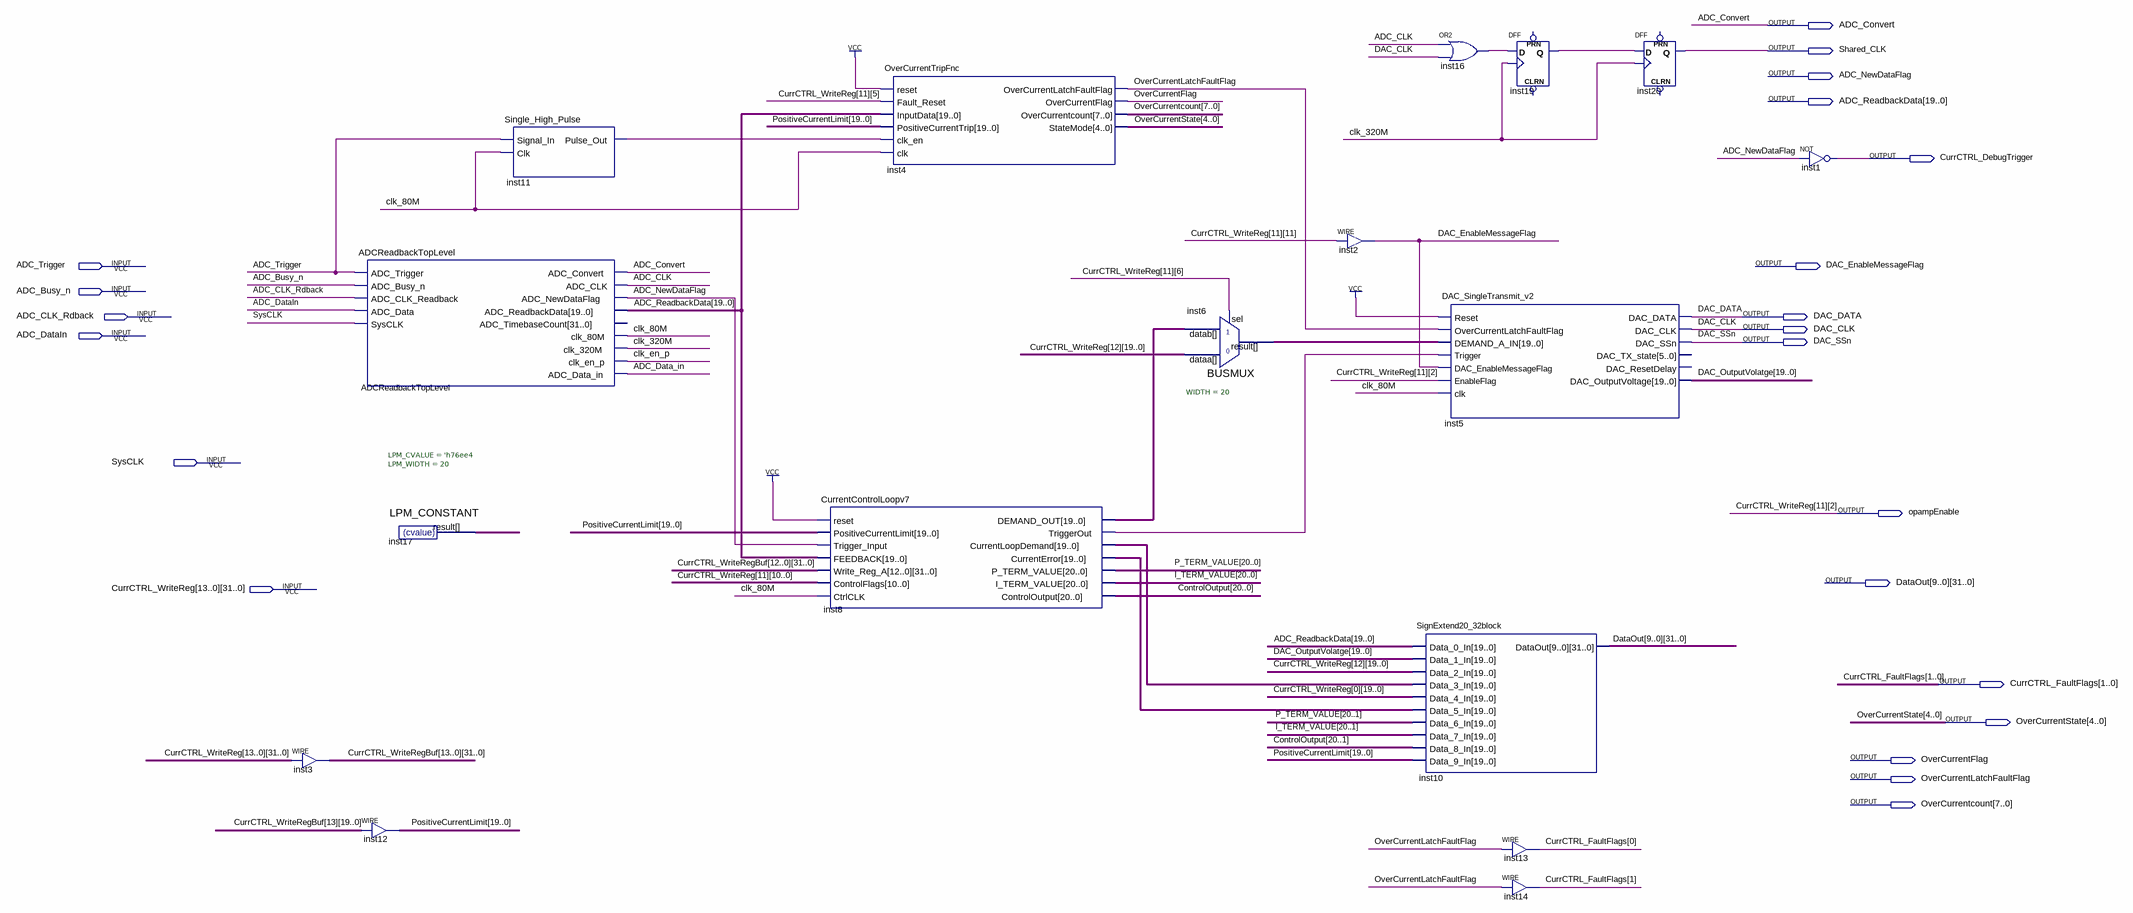
[diagram p0: schematic sheet]
// Quartus schematic CurrentControlTopLevel.bdf as structural Verilog: 17 symbols, 22 pins
module CurrentControlTopLevel (
  input  ADC_Trigger,
  input  ADC_Busy_n,
  input  ADC_CLK_Rdback,
  input  ADC_DataIn,
  input  SysCLK,
  input  [31:0] CurrCTRL_WriteReg_13,
  input  [31:0] CurrCTRL_WriteReg_12,
  input  [31:0] CurrCTRL_WriteReg_11,
  input  [31:0] CurrCTRL_WriteReg_10,
  input  [31:0] CurrCTRL_WriteReg_9,
  input  [31:0] CurrCTRL_WriteReg_8,
  input  [31:0] CurrCTRL_WriteReg_7,
  input  [31:0] CurrCTRL_WriteReg_6,
  input  [31:0] CurrCTRL_WriteReg_5,
  input  [31:0] CurrCTRL_WriteReg_4,
  input  [31:0] CurrCTRL_WriteReg_3,
  input  [31:0] CurrCTRL_WriteReg_2,
  input  [31:0] CurrCTRL_WriteReg_1,
  input  [31:0] CurrCTRL_WriteReg_0,
  output ADC_Convert,
  output Shared_CLK,
  output ADC_NewDataFlag,
  output [19:0] ADC_ReadbackData,
  output CurrCTRL_DebugTrigger,
  output DAC_EnableMessageFlag,
  output DAC_DATA,
  output DAC_CLK,
  output DAC_SSn,
  output opampEnable,
  output [31:0] DataOut_9,
  output [31:0] DataOut_8,
  output [31:0] DataOut_7,
  output [31:0] DataOut_6,
  output [31:0] DataOut_5,
  output [31:0] DataOut_4,
  output [31:0] DataOut_3,
  output [31:0] DataOut_2,
  output [31:0] DataOut_1,
  output [31:0] DataOut_0,
  output [1:0] CurrCTRL_FaultFlags,
  output [4:0] OverCurrentState,
  output OverCurrentFlag,
  output OverCurrentLatchFaultFlag,
  output [7:0] OverCurrentcount
);

  wire ADC_CLK, ADC_Data_in, clk_80M, clk_320M, clk_en_p, inst8_triggerout, inst11_pulse_out, inst16_out,
       inst19_q;
  wire [19:0] DAC_OutputVolatge, inst6_result, inst8_currenterror, inst8_currentloopdemand, inst8_demand_out,
       inst17_result, PositiveCurrentLimit;
  wire [20:0] ControlOutput, I_TERM_VALUE, P_TERM_VALUE;
  wire [31:0] CurrCTRL_WriteRegBuf_0, CurrCTRL_WriteRegBuf_1, CurrCTRL_WriteRegBuf_2, CurrCTRL_WriteRegBuf_3,
       CurrCTRL_WriteRegBuf_4, CurrCTRL_WriteRegBuf_5, CurrCTRL_WriteRegBuf_6, CurrCTRL_WriteRegBuf_7,
       CurrCTRL_WriteRegBuf_8, CurrCTRL_WriteRegBuf_9, CurrCTRL_WriteRegBuf_10, CurrCTRL_WriteRegBuf_11,
       CurrCTRL_WriteRegBuf_12, CurrCTRL_WriteRegBuf_13;

  assign {CurrCTRL_WriteRegBuf_13, CurrCTRL_WriteRegBuf_12, CurrCTRL_WriteRegBuf_11, CurrCTRL_WriteRegBuf_10, CurrCTRL_WriteRegBuf_9, CurrCTRL_WriteRegBuf_8, CurrCTRL_WriteRegBuf_7, CurrCTRL_WriteRegBuf_6, CurrCTRL_WriteRegBuf_5, CurrCTRL_WriteRegBuf_4, CurrCTRL_WriteRegBuf_3, CurrCTRL_WriteRegBuf_2, CurrCTRL_WriteRegBuf_1, CurrCTRL_WriteRegBuf_0} = {CurrCTRL_WriteReg_13, CurrCTRL_WriteReg_12, CurrCTRL_WriteReg_11, CurrCTRL_WriteReg_10, CurrCTRL_WriteReg_9, CurrCTRL_WriteReg_8, CurrCTRL_WriteReg_7, CurrCTRL_WriteReg_6, CurrCTRL_WriteReg_5, CurrCTRL_WriteReg_4, CurrCTRL_WriteReg_3, CurrCTRL_WriteReg_2, CurrCTRL_WriteReg_1, CurrCTRL_WriteReg_0};  // WIRE inst3
  ADCReadbackTopLevel ADCReadbackTopLevel (
    .ADC_Trigger(ADC_Trigger), .ADC_Busy_n(ADC_Busy_n), .ADC_CLK_Readback(ADC_CLK_Rdback),
    .ADC_Data(ADC_DataIn), .SysCLK(SysCLK), .ADC_Convert(ADC_Convert), .ADC_CLK(ADC_CLK),
    .ADC_NewDataFlag(ADC_NewDataFlag), .ADC_ReadbackData(ADC_ReadbackData), .clk_80M(clk_80M),
    .clk_320M(clk_320M), .clk_en_p(clk_en_p), .ADC_Data_in(ADC_Data_in));  // open: ADC_TimebaseCount
  LPM_CONSTANT #(.LPM_CVALUE('h76ee4), .LPM_WIDTH(20)) inst17 (.result(inst17_result));
  assign PositiveCurrentLimit = CurrCTRL_WriteRegBuf_13[19:0];  // WIRE inst12
  Single_High_Pulse inst11 (.Signal_In(ADC_Trigger), .Clk(clk_80M), .Pulse_Out(inst11_pulse_out));
  CurrentControlLoopv7 inst8 (
    .reset(1'b1), .PositiveCurrentLimit(PositiveCurrentLimit), .Trigger_Input(ADC_NewDataFlag),
    .FEEDBACK(ADC_ReadbackData),
    .Write_Reg_A({CurrCTRL_WriteRegBuf_12, CurrCTRL_WriteRegBuf_11, CurrCTRL_WriteRegBuf_10, CurrCTRL_WriteRegBuf_9, CurrCTRL_WriteRegBuf_8, CurrCTRL_WriteRegBuf_7, CurrCTRL_WriteRegBuf_6, CurrCTRL_WriteRegBuf_5, CurrCTRL_WriteRegBuf_4, CurrCTRL_WriteRegBuf_3, CurrCTRL_WriteRegBuf_2, CurrCTRL_WriteRegBuf_1, CurrCTRL_WriteRegBuf_0}),
    .ControlFlags(CurrCTRL_WriteReg_11[10:0]), .CtrlCLK(clk_80M), .DEMAND_OUT(inst8_demand_out),
    .TriggerOut(inst8_triggerout), .CurrentLoopDemand(inst8_currentloopdemand),
    .CurrentError(inst8_currenterror), .P_TERM_VALUE(P_TERM_VALUE), .I_TERM_VALUE(I_TERM_VALUE),
    .ControlOutput(ControlOutput));
  OverCurrentTripFnc inst4 (
    .reset(1'b1), .Fault_Reset(CurrCTRL_WriteReg_11[5]), .InputData(ADC_ReadbackData),
    .PositiveCurrentTrip(PositiveCurrentLimit), .clk_en(inst11_pulse_out), .clk(clk_80M),
    .OverCurrentLatchFaultFlag(OverCurrentLatchFaultFlag), .OverCurrentFlag(OverCurrentFlag),
    .OverCurrentcount(OverCurrentcount), .StateMode(OverCurrentState));
  BUSMUX #(.WIDTH(20)) inst6 (
    .datab(inst8_demand_out), .sel(CurrCTRL_WriteReg_11[6]), .dataa(CurrCTRL_WriteReg_12[19:0]),
    .result(inst6_result));
  assign DAC_EnableMessageFlag = CurrCTRL_WriteReg_11[11];  // WIRE inst2
  or inst16 (inst16_out, ADC_CLK, DAC_CLK);
  DAC_SingleTransmit_v2 inst5 (
    .Reset(1'b1), .OverCurrentLatchFaultFlag(OverCurrentLatchFaultFlag), .DEMAND_A_IN(inst6_result),
    .Trigger(inst8_triggerout), .DAC_EnableMessageFlag(DAC_EnableMessageFlag),
    .EnableFlag(CurrCTRL_WriteReg_11[2]), .clk(clk_80M), .DAC_DATA(DAC_DATA), .DAC_CLK(DAC_CLK),
    .DAC_SSn(DAC_SSn), .DAC_OutputVoltage(DAC_OutputVolatge));  // open: DAC_TX_state, DAC_ResetDelay
  SignExtend20_32block inst10 (
    .Data_0_In(ADC_ReadbackData), .Data_1_In(DAC_OutputVolatge), .Data_2_In(CurrCTRL_WriteReg_12[19:0]),
    .Data_3_In(inst8_currentloopdemand), .Data_4_In(CurrCTRL_WriteReg_0[19:0]),
    .Data_5_In(inst8_currenterror), .Data_6_In(P_TERM_VALUE[20:1]), .Data_7_In(I_TERM_VALUE[20:1]),
    .Data_8_In(ControlOutput[20:1]), .Data_9_In(PositiveCurrentLimit),
    .DataOut({DataOut_9, DataOut_8, DataOut_7, DataOut_6, DataOut_5, DataOut_4, DataOut_3, DataOut_2, DataOut_1, DataOut_0}));
  assign CurrCTRL_FaultFlags[0] = OverCurrentLatchFaultFlag;  // WIRE inst13
  assign CurrCTRL_FaultFlags[1] = OverCurrentLatchFaultFlag;  // WIRE inst14
  DFF inst19 (.CLK(clk_320M), .D(inst16_out), .Q(inst19_q));  // open: CLRN, PRN
  DFF inst20 (.CLK(clk_320M), .D(inst19_q), .Q(Shared_CLK));  // open: CLRN, PRN
  not inst1 (CurrCTRL_DebugTrigger, ADC_NewDataFlag);

  assign opampEnable = CurrCTRL_WriteReg_11[2];
endmodule
